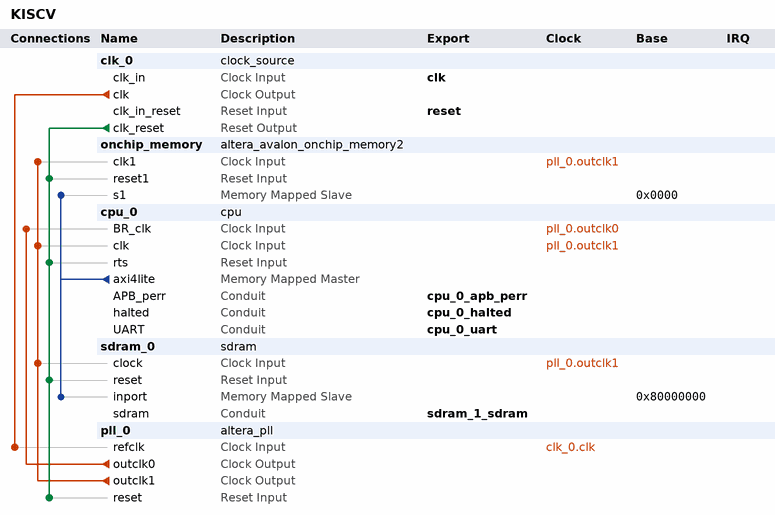
[diagram p0: system contents]
# Platform Designer (Qsys) system KISCV, Cyclone V 5CEBA4F23C7
# Parameters at their usual value, and those the tool derives, are not listed.
package require -exact qsys 22.1
create_system KISCV
set_project_property DEVICE_FAMILY {Cyclone V}
set_project_property DEVICE 5CEBA4F23C7

add_instance clk_0 clock_source 22.1
set_instance_parameter_value clk_0 clockFrequency 50000000
set_instance_parameter_value clk_0 resetSynchronousEdges DEASSERT

add_instance onchip_memory altera_avalon_onchip_memory2 22.1
set_instance_parameter_value onchip_memory dataWidth 32
set_instance_parameter_value onchip_memory dualPort false
set_instance_parameter_value onchip_memory initMemContent true
set_instance_parameter_value onchip_memory initializationFileName system.mif
set_instance_parameter_value onchip_memory memorySize 65536
set_instance_parameter_value onchip_memory useNonDefaultInitFile true

add_instance cpu_0 cpu 1.0
set_instance_parameter_value cpu_0 ADDR_WIDTH 32
set_instance_parameter_value cpu_0 DATA_WIDTH 32

add_instance sdram_0 sdram 1.0
set_instance_parameter_value sdram_0 SDRAM_ADDR_W 25
set_instance_parameter_value sdram_0 SDRAM_COL_W 10
set_instance_parameter_value sdram_0 SDRAM_MHZ 20
set_instance_parameter_value sdram_0 SDRAM_READ_LATENCY 2

add_instance pll_0 altera_pll 22.1
set_instance_parameter_value pll_0 gui_device_speed_grade 1
set_instance_parameter_value pll_0 gui_number_of_clocks 2
set_instance_parameter_value pll_0 gui_operation_mode direct
set_instance_parameter_value pll_0 gui_output_clock_frequency0 14.7456
set_instance_parameter_value pll_0 gui_output_clock_frequency1 20.0
set_instance_parameter_value pll_0 gui_pll_auto_reset On
set_instance_parameter_value pll_0 gui_pll_mode {Integer-N PLL}
set_instance_parameter_value pll_0 gui_reference_clock_frequency 50.0
set_instance_parameter_value pll_0 gui_use_locked false

# connections
add_connection clk_0.clk pll_0.refclk clock
add_connection pll_0.outclk0 cpu_0.BR_clk clock
add_connection pll_0.outclk1 cpu_0.clk clock
add_connection pll_0.outclk1 onchip_memory.clk1 clock
add_connection pll_0.outclk1 sdram_0.clock clock
add_connection clk_0.clk_reset cpu_0.rts reset
add_connection clk_0.clk_reset onchip_memory.reset1 reset
add_connection clk_0.clk_reset pll_0.reset reset
add_connection clk_0.clk_reset sdram_0.reset reset
add_connection cpu_0.axi4lite onchip_memory.s1 avalon
set_connection_parameter_value cpu_0.axi4lite/onchip_memory.s1 baseAddress 0x0000
add_connection cpu_0.axi4lite sdram_0.inport avalon
set_connection_parameter_value cpu_0.axi4lite/sdram_0.inport baseAddress 0x80000000

# exported interfaces
add_interface clk clock sink
set_interface_property clk EXPORT_OF clk_0.clk_in
add_interface cpu_0_apb_perr conduit end
set_interface_property cpu_0_apb_perr EXPORT_OF cpu_0.APB_perr
add_interface cpu_0_halted conduit end
set_interface_property cpu_0_halted EXPORT_OF cpu_0.halted
add_interface cpu_0_uart conduit end
set_interface_property cpu_0_uart EXPORT_OF cpu_0.UART
add_interface reset reset sink
set_interface_property reset EXPORT_OF clk_0.clk_in_reset
add_interface sdram_1_sdram conduit end
set_interface_property sdram_1_sdram EXPORT_OF sdram_0.sdram

set_interconnect_requirement {$system} qsys_mm.clockCrossingAdapter HANDSHAKE
set_interconnect_requirement {$system} qsys_mm.enableEccProtection FALSE
set_interconnect_requirement {$system} qsys_mm.insertDefaultSlave FALSE
set_interconnect_requirement {$system} qsys_mm.maxAdditionalLatency 1

save_system KISCV.qsys
